# Altium project IMTM-Flex.PrjPcb
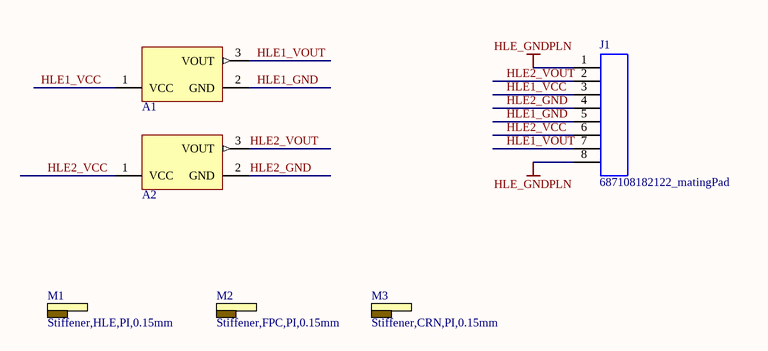
[diagram p0: IMTM-SCH02.SchDoc]
DocumentTitle: HLE Flex Interconnect; DrawnBy: Amir H. Hadi; DrawnDate: 2020.08.12; PcbDocumentNumber_1: IMTM-RIGHT-PCB03; PcbDocumentNumber_2: IMTM-LEFT-PCB04; ProjectTitle: Instrumented MTM; Rev: A; RevisedBy: Amir H. Hadi; RevisedDate: 2020.08.11; SchDocumentNumber: IMTM-SCH02; SheetTitle: Top; Ver: A
1 sheet, 6 parts. Net scope: global (net labels, ports and power ports of the same name join across sheets).
Board files: IMTM-Left-PCB04.PcbDoc, IMTM-Right-PCB03.PcbDoc

## Sheet IMTM-SCH02.SchDoc
size A

### Parts
A1  A1324LUA-T  [A1324LUA-T]  (value not drawn)
A2  A1324LUA-T  [A1324LUA-T]  (value not drawn)
J1  687108182122_matingPad  [687108182122_MATINGPAD]
M1  Stiffener,HLE,PI,0.15mm  [HLE_stiffener]  (no BOM)
M2  Stiffener,FPC,PI,0.15mm  [FPC_STIFFENER]  (no BOM)
M3  Stiffener,CRN,PI,0.15mm  [FPC_STIFFENER]  (no BOM)

### Nets
HLE_GNDPLN: J1.1 J1.8
HLE1_GND: A1.2(GND) J1.5
HLE1_VCC: A1.1(VCC) J1.3
HLE1_VOUT: A1.3(VOUT) J1.7
HLE2_GND: A2.2(GND) J1.4
HLE2_VCC: A2.1(VCC) J1.6
HLE2_VOUT: A2.3(VOUT) J1.2

### Library data of the parts
A1 A2 = A1324LUA-T: ALLEGRO MICROSYSTEMS - A1324LUA-T - Hall Effect Sensor, Linear, 10 mA, SIP, 3 Pins, 4.5 V, 5.5 V; Output Current: 10mA; Operating Supply Voltage: 5V; Max Supply Current: 9mA; Max Supply Voltage: 5.5V; Min Supply Voltage: 4.5V; Output Type: Digital; Supplier 1: Digi-Key; Manufacturer: Allegro MicroSystems; Manufacturer Part Number: A1324LUA-T; RoHS: Yes; Category: Sensors; Stock 1: 15828; Pricing 1: 1=2.00000, 5=1.89000, 10=1.62000, 25=1.29600, 50=1.18800, 100=1.08000, 500=0.94500, 1000=0.83700, 5000=0.78300 (USD); Mount: Through Hole; Case/Package: SIP; Number of Pins: 3; ComponentLink1URL: https://datasheet.ciiva.com/15099/getdatasheetpartid-367817-15099484.pdf?src-supplier=Verical; ComponentLink1Description: https://datasheet.ciiva.com/15099/getdatasheetpartid-367817-15099484.pdf?src-supplier=Verical; ComponentLink2URL: https://datasheet.ciiva.com/22624/1538021-22624823.pdf?src-supplier=Element14; ComponentLink2Description: https://datasheet.ciiva.com/22624/1538021-22624823.pdf?src-supplier=Element14; ComponentLink3URL: https://datasheet.ciiva.com/14094/a1324-26-eng-tds-14094701.pdf?src-supplier=Distrelec; ComponentLink3Description: https://datasheet.ciiva.com/14094/a1324-26-eng-tds-14094701.pdf?src-supplier=Distrelec; Package Quantity: 4000; Packaging: Bag; Operating Supply Current: 9mA; Max Output Current: 10mA; Length: 4.09mm; Height: 3.02mm; Width: 1.52mm; Radiation Hardening: No; REACH SVHC: No SVHC; Supplier Part Number 1: 620-1432-ND; Max Operating Temperature: 150°C; Min Operating Temperature: -40°C
M1 = HLE_stiffener: MECH,Stiffener,IMTM-PCB03_04,HLE; CreatedBy: A. Hadi
M2 M3 = FPC_STIFFENER: MECH,Stiffener,IMTM-PCB03_04,FPC; CreatedBy: A. Hadi